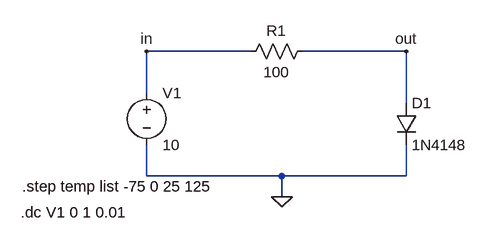
[diagram p0: schematic 1_Zadatak_Lab3.asc]
1_Zadatak_Lab3.asc, the LTspice schematic file:
Version 4
SHEET 1 880 680
WIRE 176 64 16 64
WIRE 416 64 256 64
WIRE 16 128 16 64
WIRE 416 144 416 64
WIRE 16 256 16 208
WIRE 224 256 16 256
WIRE 416 256 416 208
WIRE 416 256 224 256
WIRE 224 288 224 256
FLAG 224 288 0
FLAG 416 64 out
FLAG 16 64 in
SYMBOL voltage 16 112 R0
SYMATTR InstName V1
SYMATTR Value 10
SYMBOL res 272 48 R90
WINDOW 0 0 56 VBottom 2
WINDOW 3 32 56 VTop 2
SYMATTR InstName R1
SYMATTR Value 100
SYMBOL diode 400 144 R0
SYMATTR InstName D1
SYMATTR Value 1N4148
TEXT -176 272 Left 2 !.step temp list -75 0 25 125
TEXT -178 312 Left 2 !.dc V1 0 1 0.01

The netlist it stands for:
* 1_Zadatak_Lab3.asc
V1 in 0 10
R1 out in 100
D1 out 0 1N4148
.model D D
.lib standard.dio
.step temp list -75 0 25 125
.dc V1 0 1 0.01
.backanno
.end

* Results of the author's LTspice run, read from the files saved beside the schematic
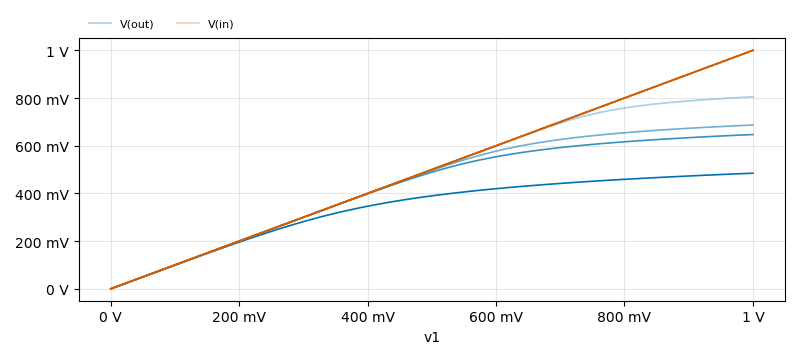
[diagram p1: DC transfer characteristic of 1_Zadatak_Lab3.asc, plotted from the saved traces]
* DC transfer characteristic, 4 runs:
*   V(out) [temp=-75°C]: 0 V at v1=0 V, 805.2 mV at v1=1 V, min 0 V, max 805.2 mV
*   V(out) [temp=0°C]: 0 V at v1=0 V, 687 mV at v1=1 V, min 0 V, max 687 mV
*   V(out) [temp=25°C]: 0 V at v1=0 V, 647 mV at v1=1 V, min 0 V, max 647 mV
*   V(out) [temp=125°C]: 0 V at v1=0 V, 484.9 mV at v1=1 V, min 0 V, max 484.9 mV
*   V(in) [temp=-75°C]: 0 V at v1=0 V, 1 V at v1=1 V, min 0 V, max 1 V
*   V(in) [temp=0°C]: 0 V at v1=0 V, 1 V at v1=1 V, min 0 V, max 1 V
*   V(in) [temp=25°C]: 0 V at v1=0 V, 1 V at v1=1 V, min 0 V, max 1 V
*   V(in) [temp=125°C]: 0 V at v1=0 V, 1 V at v1=1 V, min 0 V, max 1 V